# EAGLE design AP5100 (EAGLE 8.1.1)
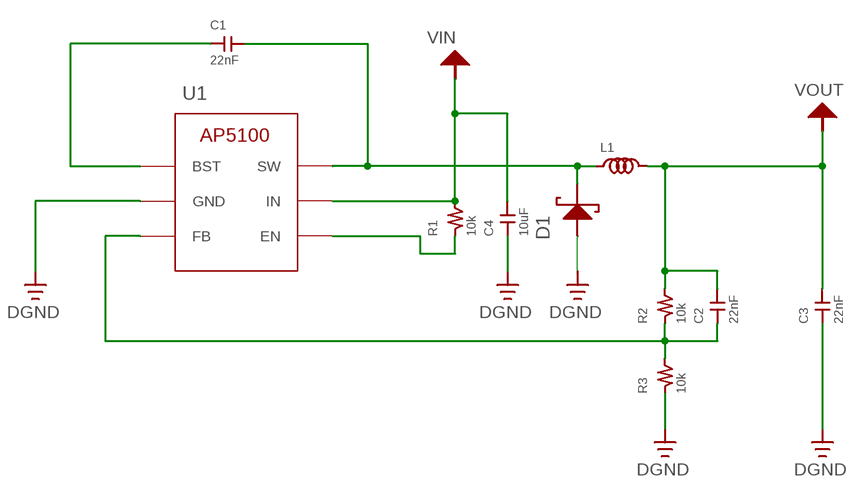
[diagram p0: schematic, sheet 1]

## Parts
C1  22nF  CAPACITOR_CHIP2012  [2012]
C2  22nF  CAPACITOR_CHIP2012  [2012]
C3  22nF  CAPACITOR_CHIP2012  [2012]
C4  10uF  CAPACITOR_CHIP2012  [2012]
D1  BAT60JFILM  [SOD323]
L1  INDUCTOR2012  [2012]
R1  10k  RESISTOR_CHIP_2012  [2012]
R2  10k  RESISTOR_CHIP_2012  [2012]
R3  10k  RESISTOR_CHIP_2012  [2012]
U1  AP5100  [SOT-26]

## Nets
BST: C1.P$1 U1.P1(BST)
DGND: C3.P$1 C4.P$1 D1.A R3.P$1 U1.P2(GND)
EN: R1.P$1 U1.P4(EN)
FB: C2.P$1 R2.P$1 R3.P$2 U1.P3(FB)
SW: C1.P$2 D1.K L1.P$1 U1.P6(SW)
VIN: C4.P$2 R1.P$2 U1.P5(IN)
VOUT: C2.P$2 C3.P$2 L1.P$2 R2.P$2

## Library data of the parts
C1-C4 = passive:CAPACITOR_CHIP
D1 = Diode:BAT60: BAT60 is Schottky barrier diode encapsulated in a SOD-323 small SMD package. This device is intended for use in portable equipments. It is suited for DC to DC converters, step-up conversion and power management.
L1 = passive:INDUCTOR
R1-R3 = passive:RESISTOR_CHIP_
U1 = Regulator:AP5100: The AP5100 is a current mode step-down converter with a built-in power MOSFET to enable smallest solution size power conversion. With the low series resistance power switch it enables a constant output current of up to 1.2A over a wide input supply range. The load and line regulation has excellent response time over the operating input voltage and temperature range. The AP5100 is self protected, through a cycle-by-cycle current limiting algorithm and an on chip thermal protection. The AP5100 will provide the voltage conversion with a low count of widely available standard external components. The AP5100 is available in SOT26 package.

## Board
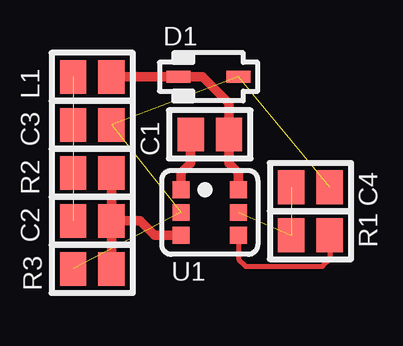
[diagram p1: board, top side]

No outline drawn. Coordinates in mm, seen from the top.
Copper layers (1*16): Top 0.035mm / dielectric 1.5mm / Bottom 0.035mm
Design rules "default": minimum track width 10mil, minimum drill 24mil, track to track 8mil, track to pad 8mil, pad to pad 8mil, via to via 8mil, smd to smd 8mil, copper to edge 40mil, drill to drill 8mil, minimum pad ring 10mil, minimum via ring 8mil, stop-mask expansion 4mil, vias tented up to drill 0mil, thermal gap 10mil

### Footprints (pad centres in the part's own frame; a part is rotated, then mirrored left to right if it is on the bottom)
2012 = smd 1.4 x 1.1: P$1 0,0.8; P$2 0,-0.8
SOD323 = smd 1 x 0.5: A -1.3,0; K 1.2,0
SOT-26 = smd 0.7 x 0.7: P1 0,0; P2 0,-0.95; P3 0,-1.9; P4 2.4,-1.9; P5 2.4,-0.95; P6 2.4,0

### Placement (x,y rotation side)
C1  1.2,2.3 90 top
C2  -3.7,-1.3 270 top
C3  -3.7,2.7 270 top
C4  5.4,0.1 270 top
D1  1.1,4.7 180 top
L1  -3.7,4.7 270 top
R1  5.4,-1.9 270 top
R2  -3.7,0.7 270 top
R3  -3.7,-3.3 90 top
U1  0,0 0 top

### Tracks (layer width: path | path; a pad name or v marks a point on that pad's centre or on a via)
BST
  Top 0.4: U1.P1 0,0.7 0.4,1.1 C1.P$1
DGND  (4 unrouted)
EN
  Top 0.2: U1.P4 2.4,-2.9 2.7,-3.2 5.9,-3.2 6.2,-2.9 R1.P$1
FB
  Top 0.4: C2.P$1 R2.P$1 | C2.P$1 R3.P$2 | U1.P3 -1.1,-1.9 -1.7,-1.3 C2.P$1
SW
  Top 0.4: U1.P6 2.4,0.7 2,1.1 C1.P$2 2,3.6 0.9,4.7 D1.K L1.P$1
VIN  (2 unrouted)
VOUT  (3 unrouted)